# EAGLE design Dashboard rev5 (EAGLE 8.1.0)
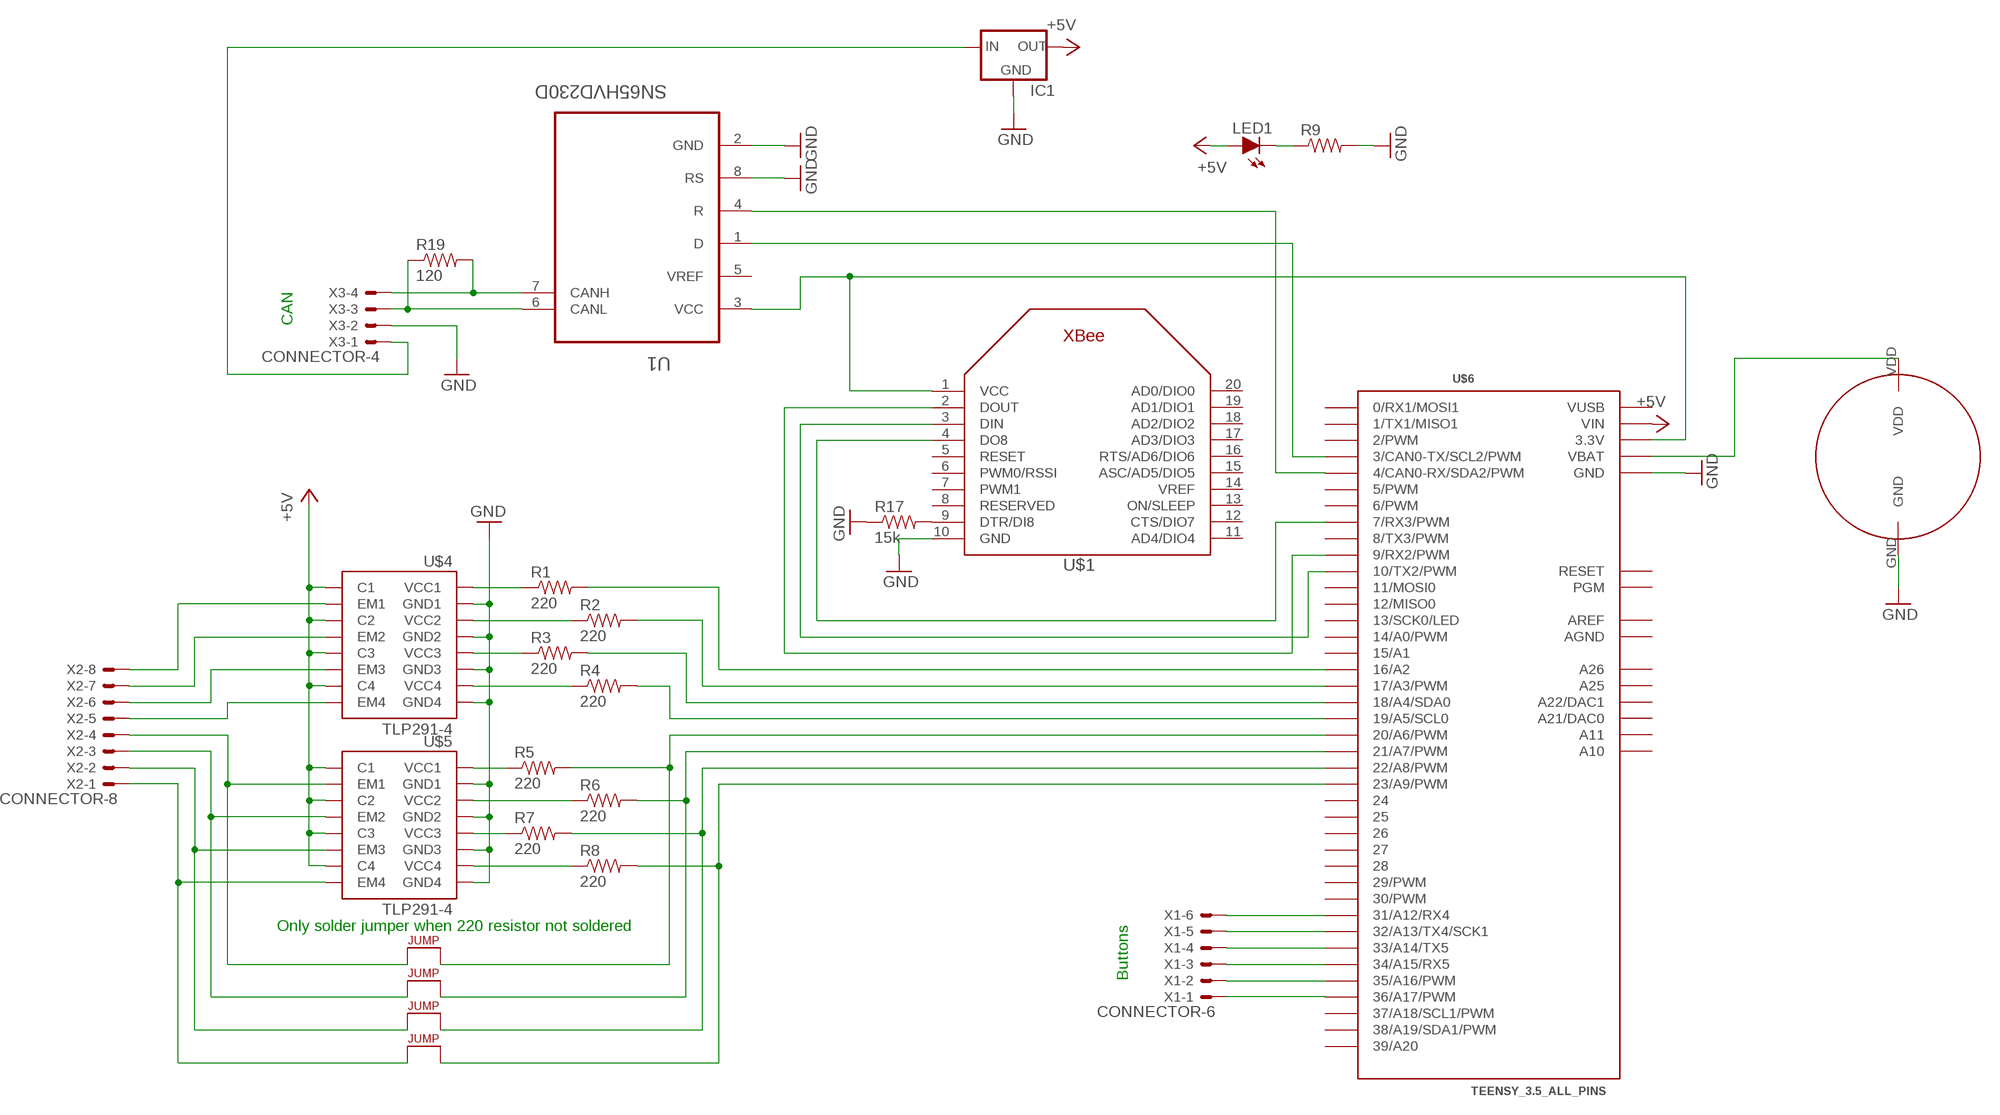
[diagram p0: schematic, sheet 1]

## Parts
BATT  COIN-CELL-HOLDER  [COIN-CELL-HOLDER]
IC1  5VREG_L7805SPACED  [TO-220-SPACED]
LED1  LED-0805  [LED-805]
R1  220  RESISTOR0805-RES  [0805]
R2  220  RESISTOR0805-RES  [0805]
R3  220  RESISTOR0805-RES  [0805]
R4  220  RESISTOR0805-RES  [0805]
R5  220  RESISTOR0805-RES  [0805]
R6  220  RESISTOR0805-RES  [0805]
R7  220  RESISTOR0805-RES  [0805]
R8  220  RESISTOR0805-RES  [0805]
R9  RESISTOR0805-RES  [0805]
R17  15k  RESISTOR0805-RES  [0805]
R19  120  RESISTOR0805-RES  [0805]
U1  SN65HVD230D  [SOIC127P600X175-8N]
U$1  XBEE  [XBEE]
U$3  JUMPER  [0805]
U$4  TLP291-4  [SOIC-16]
U$5  TLP291-4  [SOIC-16]
U$6  TEENSY_3.5_ALL_PINS  [TEENSY_3.5_ALL_PINS]
U$7  JUMPER  [0805]
U$8  JUMPER  [0805]
U$9  JUMPER  [0805]
X1  CONNECTOR-6  [MINIFIT_5566-6]
X2  CONNECTOR-8  [MINIFIT_5566-8]
X3  CONNECTOR-4  [MINIFIT_5566-4]

## Nets
+5V: IC1.3(OUT) LED1.A U$4.10(C4) U$4.12(C3) U$4.14(C2) U$4.16(C1) U$5.10(C4) U$5.12(C3) U$5.14(C2) U$5.16(C1) U$6.VIN
GND: BATT.GND IC1.2(GND) R9.2 R17.1 U1.2(GND) U1.8(RS) U$1.10(GND) U$4.2(GND1) U$4.4(GND2) U$4.6(GND3) U$4.8(GND4) U$5.2(GND1) U$5.4(GND2) U$5.6(GND3) U$5.8(GND4) U$6.GND U$6.GND1(GND) U$6.GND3(GND) U$6.GND4(GND) U$6.GND6(GND) X3.2
N$1: U$4.15(EM1) X2.8
N$2: U$1.2(DOUT) U$6.9(9/RX2/PWM)
N$3: U$4.13(EM2) X2.7
N$4: U$4.11(EM3) X2.6
N$5: R1.1 U$4.1(VCC1)
N$6: U$6.36/A17(36/A17/PWM) X1.1
N$7: R2.1 U$4.3(VCC2)
N$8: R3.1 U$4.5(VCC3)
N$9: U$1.3(DIN) U$6.10(10/TX2/PWM)
N$10: U$1.4(DO8) U$6.7(7/RX3/PWM)
N$11: R4.1 U$4.7(VCC4)
N$12: R5.1 U$5.1(VCC1)
N$13: R17.2 U$1.9(DTR/DI8)
N$14: R6.1 U$5.3(VCC2)
N$15: R7.1 U$5.5(VCC3)
N$16: R8.1 U$5.7(VCC4)
N$17: U$6.31/A12(31/A12/RX4) X1.6
N$18: LED1.C R9.1
N$19: U$6.32/A13(32/A13/TX4/SCK1) X1.5
N$20: U$6.33/A14(33/A14/TX5) X1.4
N$21: U$6.34/A15(34/A15/RX5) X1.3
N$22: U$6.35/A16(35/A16/PWM) X1.2
N$23: BATT.VDD U$6.VBAT
N$24: U1.1(D) U$6.3(3/CAN0-TX/SCL2/PWM)
N$25: U$4.9(EM4) X2.5
N$29: U$3.1 U$5.15(EM1) X2.4
N$30: U$5.13(EM2) U$7.1 X2.3
N$31: U$5.11(EM3) U$8.1 X2.2
N$32: U$5.9(EM4) U$9.1 X2.1
N$36: U1.4(R) U$6.4(4/CAN0-RX/SDA2/PWM)
N$37: R19.2 U1.7(CANH) X3.4
N$38: R1.2 U$6.16/A2
N$39: R2.2 U$6.17/A3(17/A3/PWM)
N$40: R3.2 U$6.18/A4(18/A4/SDA0)
N$41: R19.1 U1.6(CANL) X3.3
N$43: IC1.1(IN) X3.1
N$48: R4.2 U$6.19/A5(19/A5/SCL0)
N$49: R5.2 U$3.2 U$6.20/A6(20/A6/PWM)
N$50: R6.2 U$6.21/A7(21/A7/PWM) U$7.2
N$51: R7.2 U$6.22/A8(22/A8/PWM) U$8.2
N$54: R8.2 U$6.23/A9(23/A9/PWM) U$9.2
VCC: U1.3(VCC) U$1.1(VCC) U$6.3.3V U$6.3.3V3(3.3V) U$6.3.3V4(3.3V)
Unconnected: U1.5(VREF) U$1.5(RESET) U$1.6(PWM0/RSSI) U$1.7(PWM1) U$1.8(RESERVED) U$1.11(AD4/DIO4) U$1.12(CTS/DIO7) U$1.13(ON/SLEEP) U$1.14(VREF) U$1.15(ASC/AD5/DIO5) U$1.16(RTS/AD6/DIO6) U$1.17(AD3/DIO3) U$1.18(AD2/DIO2) U$1.19(AD1/DIO1) U$1.20(AD0/DIO0) U$6.0(0/RX1/MOSI1) U$6.1(1/TX1/MISO1) U$6.2(2/PWM) U$6.5(5/PWM) U$6.6(6/PWM) U$6.8(8/TX3/PWM) U$6.11(11/MOSI0) U$6.12(12/MISO0) U$6.13(13/SCK0/LED) U$6.14/A0(14/A0/PWM) U$6.15/A1 U$6.24 U$6.25 U$6.26 U$6.27 U$6.28 U$6.29(29/PWM) U$6.30(30/PWM) U$6.37/A18(37/A18/SCL1/PWM) U$6.38/A19(38/A19/SDA1/PWM) U$6.39/A20 U$6.A10 U$6.A11 U$6.A21(A21/DAC0) U$6.A22(A22/DAC1) U$6.A25 U$6.A26 U$6.PGM U$6.RESET

## Notes on the sheet
- CAN
- Only solder jumper when 220 resistor not soldered
- Buttons

## Power pins joined to a net without a drawn wire
AGND: U$6.AGND
AREF: U$6.AREF
VUSB: U$6.VUSB

## Library data of the parts
BATT = HyTechDevices2:COIN-CELL-HOLDER
IC1 = HyTechDevices2:5VREG_L7805: Voltage Regulator Switching 5v regulator Datasheet <http://power.murata.com/data/power/oki-78sr.pdf> Standard 7805 5V regulator. IGO (Input Ground Output). Spark Fun Electronics SKU : COM-00107 Datasheet <http://www.mouser.com/ds/2/308/MC7800-D-94905.pdf>
LED1 = HyTechDevices:LED: Light Emitting Diode (LED) Source: Dangerous Prototypes Eagle Library <https://github.com/DangerousPrototypes/Eagle_Part_Library>
R1-R9 R17 R19 = HyTechDevices:RESISTOR: Resistor Basic schematic elements and footprints for 0603, 1206, and PTH resistors.
U1 = Texas Instruments:SN65HVD230D: 3.3-V CAN TRANSCEIVERS; MPN: SN65HVD230D; OC_FARNELL: 1103105; OC_NEWARK: 75C7744; PACKAGE: SOIC-8; SUPPLIER: Texas Instruments
U$1 = HyTechDevices:XBEE: Source: Adafruit <https://github.com/adafruit/Adafruit-Eagle-Library>
U$3 U$7-U$9 = HyTechDevices:JUMPER: Jumper for changing operation of a device
U$4 U$5 = HyTechDevices:TLP291-4: Toshiba Quad Channel Optocoupler TLP291-4
U$6 = Teensy_3_and_LC_Series_Boards_v1.4:TEENSY_3.5_ALL_PINS: All PIN version of the Teensy 3.5. Note: the NC pin is not shown in symbol package, not connected here either.
X1 = HyTechDevices2:CONNECTOR-6: Mini-Fit Junior connector 6 pole Source: http://www.molex.com; MPN: 95566-61002; OC_FARNELL: unknown; OC_NEWARK: 22K8620
X2 = HyTechDevices2:CONNECTOR-8: Mini-Fit Junior connector 8 pole Source: http://www.molex.com; OC_FARNELL: unknown; OC_NEWARK: unknown
X3 = HyTechDevices2:CONNECTOR-4: Mini-Fit Junior connector 4 pole Source: http://www.molex.com; OC_FARNELL: unknown; OC_NEWARK: unknown

## Board
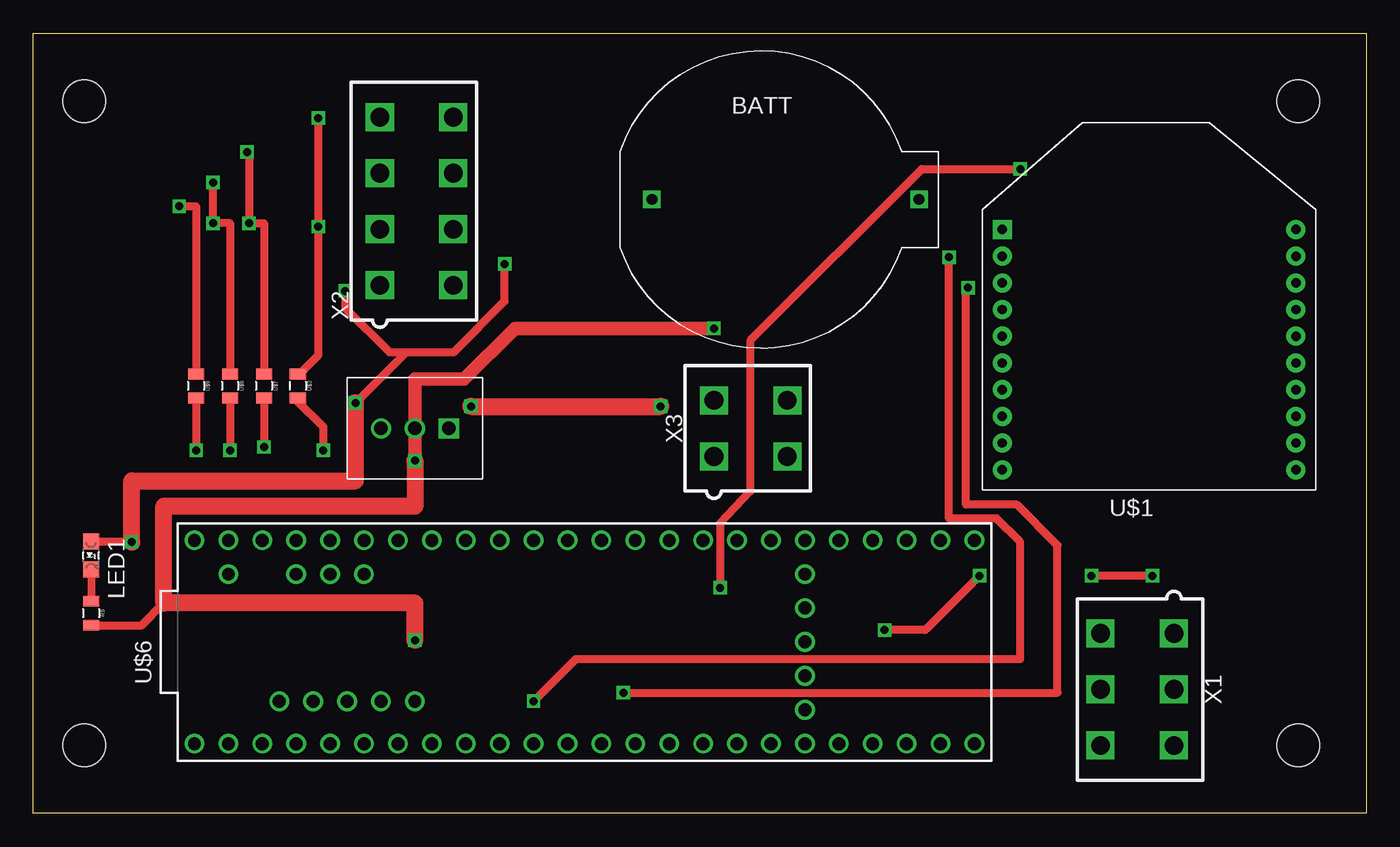
[diagram p1: board, top side]
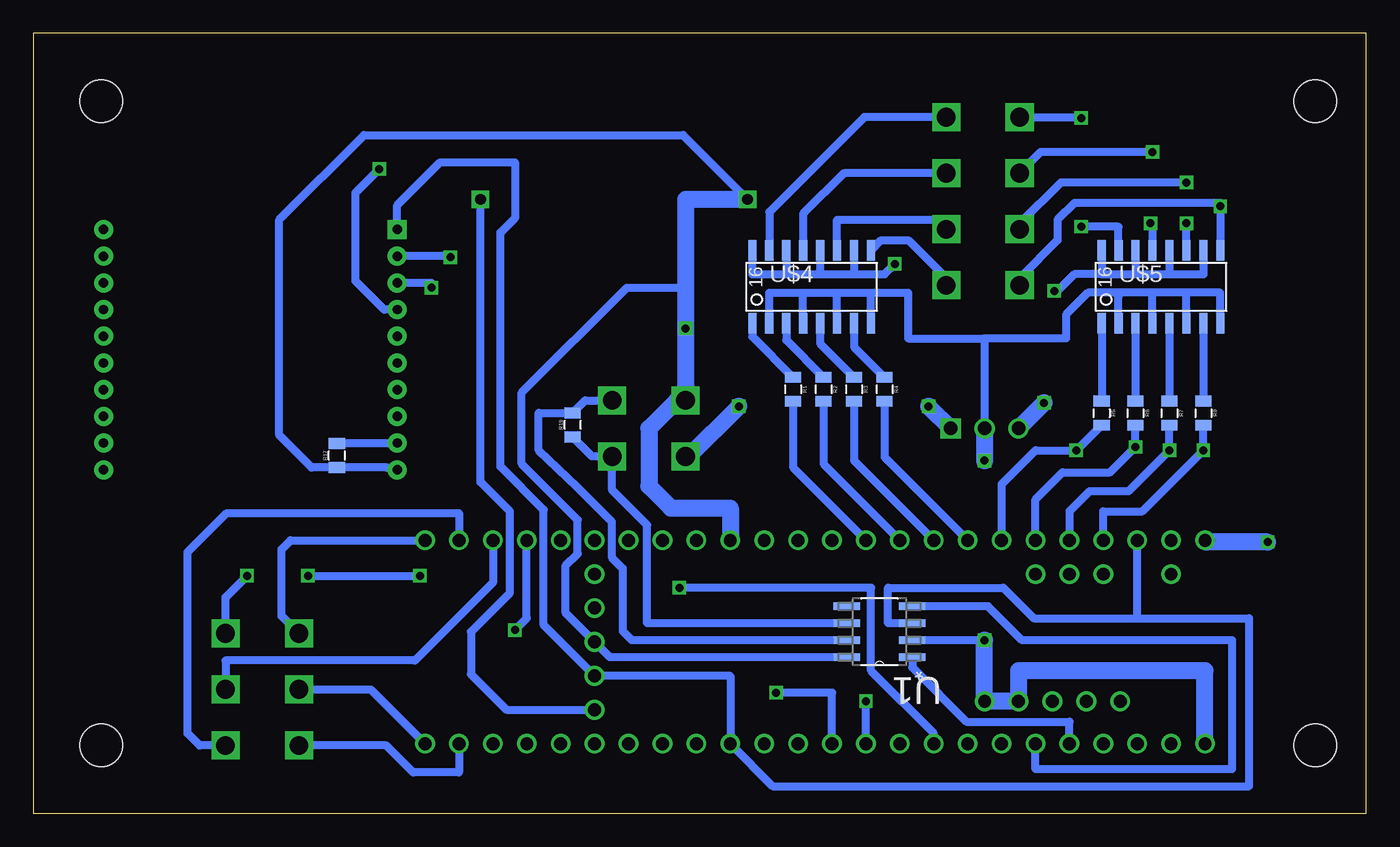
[diagram p2: board, bottom side, seen from below]

Size 99.82 x 58.42 mm. Coordinates in mm from the lower left corner, seen from the top.
Outline: 0,0 0,58.42 99.82,58.42 99.82,0 0,0
Copper layers (1*16): Top 0.035mm / dielectric 1.5mm / Bottom 0.035mm
Design rules "default *": minimum track width 10mil, minimum drill 24mil, track to track 16mil, track to pad 16mil, pad to pad 16mil, via to via 16mil, smd to smd 16mil, copper to edge 40mil, drill to drill 8mil, minimum pad ring 10mil, minimum via ring 8mil, stop-mask expansion 4mil, vias tented up to drill 0mil, thermal gap 10mil
Holes 3.2 mm at 3.81,53.34 3.81,5.08 94.74,5.08 94.74,53.34

### Footprints (pad centres in the part's own frame; a part is rotated, then mirrored left to right if it is on the bottom)
COIN-CELL-HOLDER = drill 0.8 square: GND -8.15,0; VDD 11.85,0
TO-220-SPACED = drill 1 square: 1 -2.54,0 | drill 1: 2 0,0; 3 2.54,0
LED-805 = smd 1.2 x 1.2: A 0,-1.05; C 0,1.05
0805 = smd 0.8 x 1.2: 1 -0.9,0; 2 0.9,0
SOIC127P600X175-8N = smd 1.981 x 0.559: 1 -2.464,1.905; 2 -2.464,0.635; 3 -2.464,-0.635; 4 -2.464,-1.905; 5 2.464,-1.905; 6 2.464,-0.635; 7 2.464,0.635; 8 2.464,1.905
XBEE = drill 0.7 pad 1.422 square: 1 -11,5.5 | drill 0.7 pad 1.422: 2 -11,3.5; 3 -11,1.5; 4 -11,-0.5; 5 -11,-2.5; 6 -11,-4.5; 7 -11,-6.5; 8 -11,-8.5; 9 -11,-10.5; 10 -11,-12.5; 11 11,-12.5; 12 11,-10.5; 13 11,-8.5; 14 11,-6.5; 15 11,-4.5; 16 11,-2.5; 17 11,-0.5; 18 11,1.5; 19 11,3.5; 20 11,5.5
SOIC-16 = smd 0.61 x 1.524: 1 -4.445,-2.794; 2 -3.175,-2.794; 3 -1.905,-2.794; 4 -0.635,-2.794; 5 0.635,-2.794; 6 1.905,-2.794; 7 3.175,-2.794; 8 4.445,-2.794; 9 4.445,2.667; 10 3.175,2.667; 11 1.905,2.667; 12 0.635,2.667; 13 -0.635,2.667; 14 -1.905,2.667; 15 -3.175,2.667; 16 -4.445,2.667
TEENSY_3.5_ALL_PINS = drill 0.965: 0 -7.62,27.94; 1 -7.62,25.4; 2 -7.62,22.86; 3 -7.62,20.32; 3.3V 7.62,25.4; 3.3V3 -7.62,-5.08; 3.3V4 -2.54,-15.24; 4 -7.62,17.78; 5 -7.62,15.24; 6 -7.62,12.7; 7 -7.62,10.16; 8 -7.62,7.62; 9 -7.62,5.08; 10 -7.62,2.54; 11 -7.62,0; 12 -7.62,-2.54; 13 7.62,-2.54; 14/A0 7.62,0; 15/A1 7.62,2.54; 16/A2 7.62,5.08; 17/A3 7.62,7.62; 18/A4 7.62,10.16; 19/A5 7.62,12.7; 20/A6 7.62,15.24; 21/A7 7.62,17.78; 22/A8 7.62,20.32; 23/A9 7.62,22.86; 24 -7.62,-7.62; 25 -7.62,-10.16; 26 -7.62,-12.7; 27 -7.62,-15.24; 28 -7.62,-17.78; 29 -7.62,-20.32; 30 -7.62,-22.86; 31/A12 -7.62,-25.4; 32/A13 -7.62,-27.94; 33/A14 7.62,-27.94; 34/A15 7.62,-25.4; 35/A16 7.62,-22.86; 36/A17 7.62,-20.32; 37/A18 7.62,-17.78; 38/A19 7.62,-15.24; 39/A20 7.62,-12.7; A10 5.08,20.32; A11 5.08,17.78; A21 7.62,-10.16; A22 7.62,-7.62; A25 -4.445,19.05; A26 -4.445,21.59; AGND 7.62,27.94; AREF 5.08,22.86; GND -7.62,30.48; GND1 7.62,-5.08; GND3 -4.445,16.51; GND4 -4.445,13.97; GND6 0,-15.24; NC -4.445,24.13; PGM 2.54,-15.24; RESET 5.08,-15.24; VBAT -5.08,-15.24; VIN 7.62,30.48; VUSB 5.08,27.94
MINIFIT_5566-6 = drill 1.4 square: 1 4.2,-2.75; 2 0,-2.75; 3 -4.2,-2.75; 4 4.2,2.75; 5 0,2.75; 6 -4.2,2.75
MINIFIT_5566-8 = drill 1.4 square: 1 6.3,-2.75; 2 2.1,-2.75; 3 -2.1,-2.75; 4 -6.3,-2.75; 5 6.3,2.75; 6 2.1,2.75; 7 -2.1,2.75; 8 -6.3,2.75
MINIFIT_5566-4 = drill 1.4 square: 1 2.1,-2.75; 2 -2.1,-2.75; 3 2.1,2.75; 4 -2.1,2.75

### Placement (x,y rotation side)
BATT  54.48,45.97 0 top
IC1  28.57,28.83 180 top
LED1  4.32,19.3 180 top
R1  42.93,31.75 270 bottom
R2  40.64,31.75 270 bottom
R3  38.35,31.75 270 bottom
R4  36.07,31.75 270 bottom
R5  19.81,29.97 270 bottom
R6  17.27,29.97 270 bottom
R7  14.73,29.97 270 bottom
R8  12.19,29.97 270 bottom
R9  4.32,14.99 270 top
R17  77.09,26.8 90 bottom
R19  59.44,29.08 90 bottom
U1  36.45,13.59 180 bottom
U$1  83.57,38.23 0 top
U$3  19.81,32 270 top
U$4  41.53,39.5 0 bottom
U$5  15.37,39.5 0 bottom
U$6  42.55,12.83 90 top
U$7  17.27,32 270 top
U$8  14.73,32 270 top
U$9  12.19,32 270 top
X1  82.68,9.27 90 top
X2  28.7,45.85 270 top
X3  53.72,28.83 270 top

### Tracks (layer width: path | path; a pad name or v marks a point on that pad's centre or on a via)
+5V  (via drill 0.6)
  Top 0.61: v35.31,41.15 35.31,38.35 31.5,34.54 27.94,34.54 | v24.13,30.73 27.94,34.54 | LED1.A 7.33,20.35 v7.37,20.32 | 27.94,34.54 26.67,34.54 23.37,37.85 v23.37,39.12
  Top 1.27: v7.37,20.32 7.37,24.89 24.13,24.89 v24.13,30.73
  Bottom 0.61: 38.35,40.39 36.07,40.39 v35.31,41.15 | 40.89,40.39 38.35,40.39 | 43.43,40.39 40.89,40.39 | 14.73,40.39 12.19,40.39 U$5.10 | 17.27,40.39 14.73,40.39 | 19.81,40.39 17.27,40.39 | 19.81,40.39 21.84,40.39 23.11,39.12 v23.37,39.12 | U$4.10 38.35,40.39 | U$4.12 40.89,40.39 | U$4.14 43.43,40.39 | U$4.16 45.97,40.39 43.43,40.39 | U$5.12 14.73,40.39 | U$5.14 17.27,40.39 | U$5.16 19.81,40.39
  Bottom 1.27: IC1.3 v24.13,30.73 | v7.37,20.32 11.94,20.32 U$6.VIN
GND  (via drill 0.6)
  Top 0.61: R9.2 8.12,14.09 9.78,15.75
  Top 1.016: v50.97,36.32 36.07,36.32 32.26,32.51 28.57,32.51 v28.57,26.42
  Top 1.27: v28.57,26.42 28.57,22.99 9.78,22.99 9.78,15.75 28.57,15.75 v28.57,12.95
  Bottom 0.61: v28.57,12.95 U1.2 | 28.57,35.56 34.29,35.56 34.29,38.99 37.08,38.99 | 39.62,38.99 37.08,38.99 | 42.16,38.99 39.62,38.99 | 42.16,38.99 44.7,38.99 U$4.2 | 28.57,35.56 22.48,35.56 22.48,37.34 20.83,38.99 18.8,38.99 | 16,38.99 18.8,38.99 | 13.46,38.99 16,38.99 | 13.46,38.99 10.92,38.99 U$5.8 | U1.8 56.64,11.68 U$6.GND6 59.94,14.99 59.94,18.54 59.05,19.43 59.05,21.97 63.25,26.16 63.25,31.5 55.37,39.37 50.97,39.37 | U$4.4 42.16,38.99 | U$4.6 39.62,38.99 | U$4.8 37.08,38.99 | U$5.2 18.54,38.73 18.8,38.99 | U$5.4 16,38.99 | U$5.6 13.46,38.99 | 28.57,35.56 IC1.2 | BATT.GND 51.16,50.8 75.06,50.8 81.41,44.45 81.41,28.32 78.98,25.9 R17.1 73.33,25.9 U$1.10
  Bottom 1.27: U$6.GND 12.06,10.67 26.04,10.67 U$6.GND3 U$6.GND4 v28.57,12.95 | IC1.2 v28.57,26.42 | U$6.GND1 47.62,22.86 52.07,22.86 53.72,24.51 53.72,28.83 51.62,30.93 X3.2 v50.97,36.32 50.97,39.37 50.97,45.97 BATT.GND
N$1
  Bottom 0.61: X2.8 37.59,52.15 44.7,45.03 U$4.15
N$2  (via drill 0.6)
  Top 0.61: v37.47,8.38 40.64,11.56 73.91,11.56 73.91,20.32 72.14,22.1 68.58,22.1 v68.58,41.66
  Bottom 0.61: U$6.9 v37.47,8.38 | v68.58,41.66 68.58,41.73 U$1.2
N$3
  Bottom 0.61: X2.7 39.12,47.95 42.16,44.9 U$4.13
N$4
  Bottom 0.61: X2.6 31.5,43.75 31.5,44.45 39.62,44.45 U$4.11
N$5
  Bottom 0.61: U$4.1 45.97,35.7 R1.1
N$6  (via drill 0.6)
  Top 0.61: v83.82,17.78 v79.25,17.78 | v70.87,17.78 66.8,13.72 v63.75,13.72
  Bottom 0.61: v79.25,17.78 v70.87,17.78 | v63.75,13.72 62.87,14.61 U$6.36/A17 | X1.1 85.43,16.17 v83.82,17.78
N$7
  Bottom 0.61: U$4.3 43.43,35.44 R2.1
N$8
  Bottom 0.61: U$4.5 40.89,35.19 R3.1
N$9  (via drill 0.6)
  Top 0.61: v44.2,9.02 76.71,9.02 76.71,20.07 73.66,23.11 69.85,23.11 69.85,39.37 v70,39.37
  Bottom 0.61: U$6.10 40.01,9.02 v44.2,9.02 | v70,39.37 70,39.73 U$1.3
N$10  (via drill 0.6)
  Top 0.61: v51.44,16.89 51.44,21.72 53.72,24.13 53.72,35.43 66.55,48.26 v73.91,48.26
  Bottom 0.61: v51.44,16.89 37.08,16.89 37.08,10.67 32.38,5.97 U$6.7 | U$1.4 73.54,37.73 75.69,39.88 75.69,46.48 v73.91,48.26
N$11
  Bottom 0.61: U$4.7 38.35,34.94 R4.1
N$12
  Bottom 0.61: U$5.1 R5.1
N$13
  Bottom 0.61: U$1.9 73.33,27.7 R17.2
N$14
  Bottom 0.61: U$5.3 R6.1
N$15
  Bottom 0.61: U$5.5 R7.1
N$16
  Bottom 0.61: U$5.7 R8.1
N$17
  Bottom 0.61: U$6.31/A12 67.94,3.05 71.37,3.05 73.4,5.07 X1.6
N$18
  Top 0.61: LED1.C R9.1
N$19
  Bottom 0.61: X1.5 74.55,9.27 U$6.32/A13
N$20
  Bottom 0.61: U$6.33/A14 80.56,20.45 81.23,19.77 81.23,14.78 X1.4
N$21
  Bottom 0.61: U$6.34/A15 67.94,22.48 85.34,22.48 88.27,19.56 88.27,5.97 87.38,5.08 87.38,5.07 X1.3
N$22
  Bottom 0.61: X1.2 85.43,11.43 71.25,11.43 65.41,17.27 U$6.35/A16
N$23
  Bottom 0.61: U$6.VBAT 64.39,7.75 67.06,10.41 67.06,13.59 64.14,16.51 64.14,22.61 66.33,24.8 BATT.VDD
N$24
  Bottom 0.61: U$6.3 22.23,6.86 29.92,6.86 33.98,10.92 U1.1 33.91,11.68
N$25
  Bottom 0.61: U$4.9 36.32,42.93 34.29,42.93 31.45,40.09 X2.5
N$29  (via drill 0.6)
  Top 0.61: U$3.1 19.95,32.9 21.34,34.29 v21.34,43.94 v21.34,52.07
  Bottom 0.61: U$5.15 18.54,43.94 v21.34,43.94 | X2.4 21.34,52.15 v21.34,52.07
N$30  (via drill 0.6)
  Top 0.61: v16,49.53 16.16,49.53 v16.16,44.2 17.27,44.2 U$7.1
  Bottom 0.61: v16,49.53 24.38,49.53 25.95,47.96 X2.3 | v16.16,44.2 16,44.2 U$5.13
N$31  (via drill 0.6)
  Top 0.61: U$8.1 14.73,44.2 v13.46,44.2 v13.46,47.24
  Bottom 0.61: U$5.11 v13.46,44.2 | v13.46,47.24 22.86,47.24 25.95,44.15 X2.2
N$32  (via drill 0.6)
  Top 0.61: v10.92,45.47 12.19,45.47 U$9.1
  Bottom 0.61: X2.1 25.91,39.55 25.91,40.13 23.11,42.93 23.11,44.45 21.84,45.72 10.92,45.72 v10.92,45.47 U$5.9
N$36
  Bottom 0.61: U$6.4 24.77,3.3 10.03,3.3 10.03,12.95 25.78,12.95 28.32,15.49 U1.4
N$37
  Bottom 0.61: U1.7 54.99,12.95 55.69,13.65 55.69,18.35 56.52,19.18 56.52,21.84 59.05,24.38 61.98,27.18 61.98,29.98 R19.2 58.49,30.93 X3.4
N$38
  Bottom 0.61: R1.2 42.93,25.91 U$6.16/A2
N$39
  Bottom 0.61: R2.2 40.64,26.16 U$6.17/A3
N$40
  Bottom 0.61: R3.2 38.35,26.42 U$6.18/A4
N$41
  Bottom 0.61: 56.47,26.67 X3.3 | 56.52,26.73 X3.3 | X3.3 56.47,24.21 53.85,21.59 53.85,14.22 U1.6 | X3.3 57.98,26.73 R19.1
N$43  (via drill 0.6)
  Top 1.27: v32.77,30.48 v46.99,30.48
  Bottom 1.27: X3.1 50.74,26.73 v46.99,30.48 | v32.77,30.48 IC1.1
N$48
  Bottom 0.61: R4.2 36.07,26.67 U$6.19/A5
N$49  (via drill 0.6)
  Top 0.61: v21.71,27.18 21.71,28.96 19.81,30.85 U$3.2
  Bottom 0.61: U$6.20/A6 27.3,24.64 24.77,27.18 v21.71,27.18 R5.2
N$50  (via drill 0.6)
  Top 0.61: U$7.2 v17.27,27.43
  Bottom 0.61: U$6.21/A7 24.77,23.5 22.73,25.53 19.18,25.53 v17.27,27.43 R6.2
N$51  (via drill 0.6)
  Top 0.61: U$8.2 v14.73,27.18
  Bottom 0.61: U$6.22/A8 22.23,22.61 20.7,24.13 17.78,24.13 v14.73,27.18 R7.2
N$54  (via drill 0.6)
  Top 0.61: U$9.2 v12.19,27.18
  Bottom 0.61: U$6.23/A9 19.68,22.61 16.76,22.61 v12.19,27.18 R8.2
VCC
  Bottom 0.61: U1.3 35.81,14.22 35.81,16.89 27.18,16.89 24.89,14.61 17.14,14.61 | 17.14,14.61 8.76,14.61 8.76,2.03 44.45,2.03 U$6.3.3V3 47.62,10.29 U$6.3.3V4 61.59,14.1 61.59,22.73 64.83,25.97 64.83,43.5 63.75,44.58 63.75,48.77 69.34,48.77 72.57,45.54 U$1.1 | 17.14,14.61 U$6.3.3V

### Text on the board
tDocu: HyTech 2017 Dashboard rev5